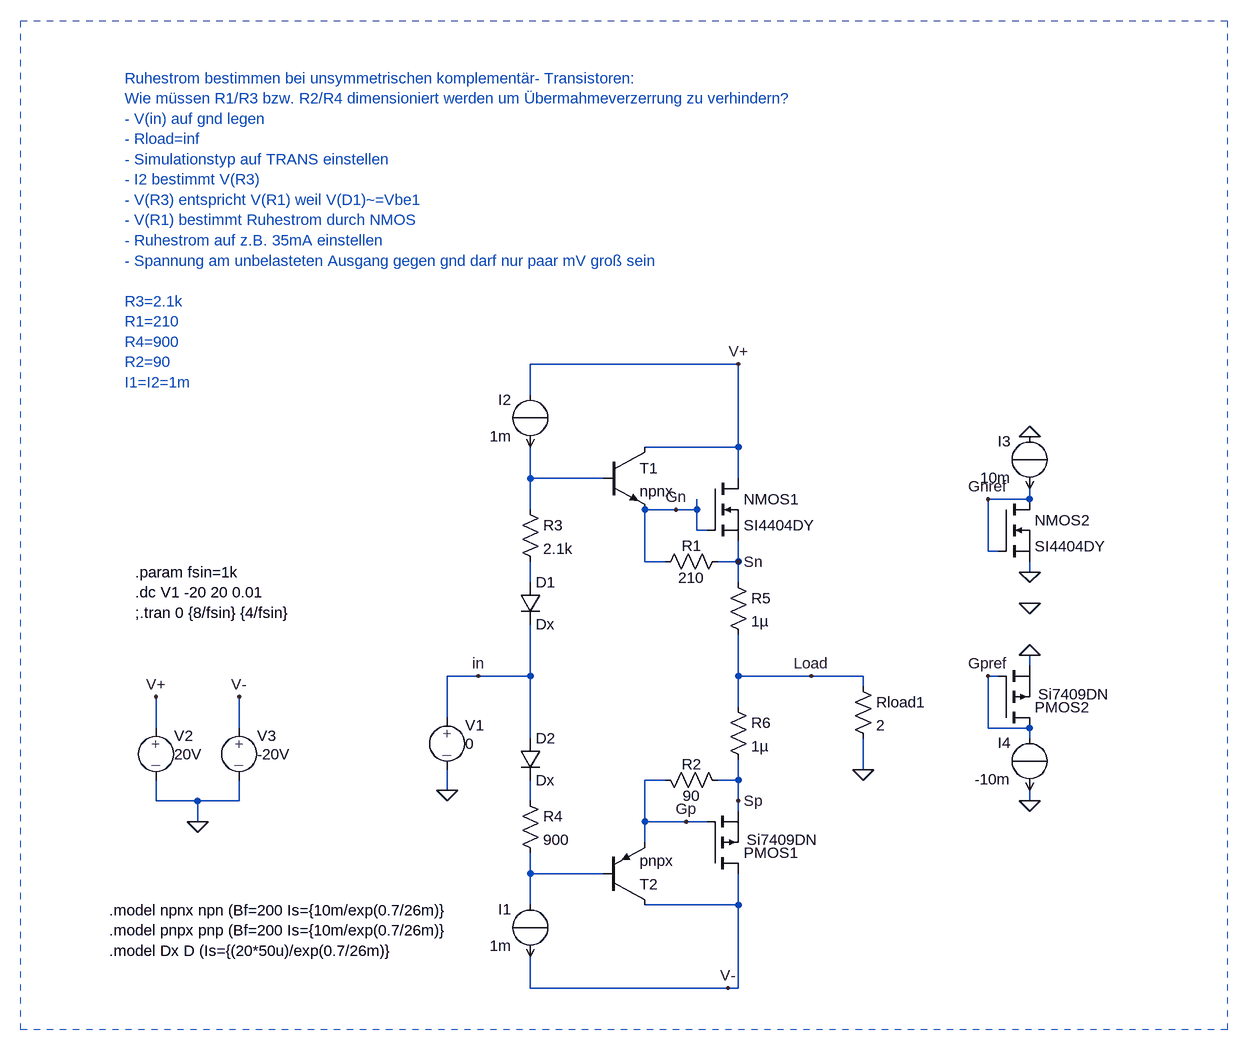
[diagram p0: schematic kompl_stufe_MOS_ruhestrom_messaufbau.asc]
kompl_stufe_MOS_ruhestrom_messaufbau.asc, the LTspice schematic file:
Version 4
SHEET 1 880 680
WIRE -544 -720 -864 -720
WIRE -864 -672 -864 -720
WIRE -544 -592 -544 -720
WIRE -544 -592 -688 -592
WIRE -864 -544 -864 -592
WIRE -752 -544 -864 -544
WIRE -544 -544 -544 -592
WIRE -96 -512 -96 -528
WIRE -96 -512 -160 -512
WIRE -864 -496 -864 -544
WIRE -640 -496 -688 -496
WIRE -608 -496 -608 -512
WIRE -608 -496 -640 -496
WIRE -608 -464 -608 -496
WIRE -592 -464 -608 -464
WIRE -160 -432 -160 -512
WIRE -144 -432 -160 -432
WIRE -688 -416 -688 -496
WIRE -656 -416 -688 -416
WIRE -544 -416 -544 -448
WIRE -544 -416 -576 -416
WIRE -96 -400 -96 -416
WIRE -864 -384 -864 -416
WIRE -544 -384 -544 -416
WIRE -96 -256 -96 -272
WIRE -944 -240 -992 -240
WIRE -864 -240 -864 -320
WIRE -864 -240 -944 -240
WIRE -544 -240 -544 -304
WIRE -432 -240 -544 -240
WIRE -352 -240 -432 -240
WIRE -144 -240 -160 -240
WIRE -352 -224 -352 -240
WIRE -544 -192 -544 -240
WIRE -992 -176 -992 -240
WIRE -1440 -160 -1440 -208
WIRE -1312 -160 -1312 -208
WIRE -160 -160 -160 -240
WIRE -96 -160 -160 -160
WIRE -864 -144 -864 -240
WIRE -96 -144 -96 -160
WIRE -352 -96 -352 -144
WIRE -656 -80 -688 -80
WIRE -544 -80 -544 -112
WIRE -544 -80 -576 -80
WIRE -992 -64 -992 -96
WIRE -1440 -48 -1440 -80
WIRE -1376 -48 -1440 -48
WIRE -1312 -48 -1312 -80
WIRE -1312 -48 -1376 -48
WIRE -864 -48 -864 -80
WIRE -544 -48 -544 -80
WIRE -96 -48 -96 -64
WIRE -544 -32 -544 -48
WIRE -1376 -16 -1376 -48
WIRE -688 -16 -688 -80
WIRE -624 -16 -688 -16
WIRE -592 -16 -624 -16
WIRE -688 16 -688 -16
WIRE -864 64 -864 32
WIRE -752 64 -864 64
WIRE -864 112 -864 64
WIRE -544 112 -544 64
WIRE -544 112 -688 112
WIRE -864 240 -864 192
WIRE -560 240 -864 240
WIRE -544 240 -544 112
WIRE -544 240 -560 240
FLAG -544 -720 V+
FLAG -560 240 V-
FLAG -992 -64 0
FLAG -432 -240 Load
FLAG -352 -96 0
FLAG -624 -16 Gp
FLAG -544 -48 Sp
FLAG -544 -416 Sn
FLAG -640 -496 Gn
FLAG -96 -400 0
FLAG -96 -48 0
FLAG -96 -352 0
FLAG -96 -608 0
FLAG -96 -272 0
FLAG -160 -240 Gpref
FLAG -160 -512 Gnref
FLAG -1376 -16 0
FLAG -1440 -208 V+
FLAG -1312 -208 V-
FLAG -944 -240 in
SYMBOL EIT_Semiconductors\\npn -752 -592 R0
SYMATTR InstName T1
SYMATTR Value npnx
SYMBOL EIT_Semiconductors\\pnp -752 112 M180
SYMATTR InstName T2
SYMATTR Value pnpx
SYMBOL res -672 -400 R270
WINDOW 0 25 56 VTop 0
WINDOW 3 7 56 VBottom 0
SYMATTR InstName R1
SYMATTR Value 210
SYMBOL res -560 -64 M270
WINDOW 0 25 56 VTop 0
WINDOW 3 7 56 VBottom 0
SYMATTR InstName R2
SYMATTR Value 90
SYMBOL res -880 -512 R0
SYMATTR InstName R3
SYMATTR Value 2.1k
SYMBOL res -880 -64 R0
SYMATTR InstName R4
SYMATTR Value 900
SYMBOL diode -880 -384 R0
SYMATTR InstName D1
SYMATTR Value Dx
SYMBOL diode -880 -144 R0
SYMATTR InstName D2
SYMATTR Value Dx
SYMBOL source-V -992 -192 R0
WINDOW 3 28 56 Left 0
WINDOW 123 0 0 Left 0
WINDOW 39 0 0 Left 0
SYMATTR Value 0
SYMATTR InstName V1
SYMBOL res -368 -240 R0
SYMATTR InstName Rload1
SYMATTR Value 2
SYMBOL EIT_Semiconductors\\nmos -592 -544 R0
SYMATTR InstName NMOS1
SYMATTR Value SI4404DY
SYMBOL EIT_Semiconductors\\pmos -592 64 M180
WINDOW 3 61 52 Left 0
SYMATTR InstName PMOS1
SYMATTR Value Si7409DN
SYMBOL res -560 -400 R0
SYMATTR InstName R5
SYMATTR Value 1µ
SYMBOL res -560 -208 R0
SYMATTR InstName R6
SYMATTR Value 1µ
SYMBOL source-I -864 192 R180
WINDOW 0 29 73 Left 0
WINDOW 3 29 17 Left 0
WINDOW 123 0 0 Left 0
WINDOW 39 0 0 Left 0
SYMATTR InstName I1
SYMATTR Value 1m
SYMBOL source-I -864 -592 R180
WINDOW 0 29 73 Left 0
WINDOW 3 29 17 Left 0
WINDOW 123 0 0 Left 0
WINDOW 39 0 0 Left 0
SYMATTR InstName I2
SYMATTR Value 1m
SYMBOL EIT_Semiconductors\\nmos -144 -512 R0
SYMATTR InstName NMOS2
SYMATTR Value SI4404DY
SYMBOL EIT_Semiconductors\\pmos -144 -160 M180
WINDOW 3 61 52 Left 0
SYMATTR InstName PMOS2
SYMATTR Value Si7409DN
SYMBOL source-I -96 -528 R180
WINDOW 0 29 73 Left 0
WINDOW 3 29 17 Left 0
WINDOW 123 0 0 Left 0
WINDOW 39 0 0 Left 0
SYMATTR InstName I3
SYMATTR Value 10m
SYMBOL source-I -96 -64 R180
WINDOW 0 29 73 Left 0
WINDOW 3 29 17 Left 0
WINDOW 123 0 0 Left 0
WINDOW 39 0 0 Left 0
SYMATTR InstName I4
SYMATTR Value -10m
SYMBOL source-V -1440 -176 R0
WINDOW 3 28 56 Left 0
WINDOW 123 0 0 Left 0
WINDOW 39 0 0 Left 0
SYMATTR Value 20V
SYMATTR InstName V2
SYMBOL source-V -1312 -176 R0
WINDOW 3 28 56 Left 0
WINDOW 123 0 0 Left 0
WINDOW 39 0 0 Left 0
SYMATTR Value -20V
SYMATTR InstName V3
TEXT -1472 -400 Left 0 !.param fsin=1k\n.dc V1 -20 20 0.01\n;.tran 0 {8/fsin} {4/fsin}
TEXT -1512 120 Left 0 !.model npnx npn (Bf=200 Is={10m/exp(0.7/26m)}\n.model pnpx pnp (Bf=200 Is={10m/exp(0.7/26m)}\n.model Dx D (Is={(20*50u)/exp(0.7/26m)}
TEXT -1488 -1160 Left 0 ;Ruhestrom bestimmen bei unsymmetrischen komplementär- Transistoren:\nWie müssen R1/R3 bzw. R2/R4 dimensioniert werden um Übermahmeverzerrung zu verhindern?\n- V(in) auf gnd legen\n- Rload=inf\n- Simulationstyp auf TRANS einstellen\n- I2 bestimmt V(R3)\n- V(R3) entspricht V(R1) weil V(D1)~=Vbe1\n- V(R1) bestimmt Ruhestrom durch NMOS\n- Ruhestrom auf z.B. 35mA einstellen\n- Spannung am unbelasteten Ausgang gegen gnd darf nur paar mV groß sein\n \nR3=2.1k\nR1=210\nR4=900\nR2=90\nI1=I2=1m
RECTANGLE Normal 208 304 -1648 -1248 2

The netlist it stands for:
* kompl_stufe_MOS_ruhestrom_messaufbau.asc
Q§T1 V+ N001 Gn 0 npnx
Q§T2 V- N004 Gp 0 pnpx
R1 Gn Sn 210
R2 Sp Gp 90
R3 N001 N002 2.1k
R4 N003 N004 900
D1 N002 in Dx
D2 in N003 Dx
V1 in 0 0
Rload1 Load 0 2
M§NMOS1 V+ Gn Sn Sn SI4404DY
M§PMOS1 V- Gp Sp Sp Si7409DN
R5 Sn Load 1µ
R6 Load Sp 1µ
I1 N004 V- 1m
I2 V+ N001 1m
M§NMOS2 Gnref Gnref 0 0 SI4404DY
M§PMOS2 Gpref Gpref 0 0 Si7409DN
I3 0 Gnref 10m
I4 Gpref 0 -10m
V2 V+ 0 20V
V3 V- 0 -20V
.model D D
.lib standard.dio
.model NPN NPN
.model PNP PNP
.lib standard.bjt
.model NMOS NMOS
.model PMOS PMOS
.lib standard.mos
.param fsin=1k
.dc V1 -20 20 0.01
;.tran 0 {8/fsin} {4/fsin}
.model npnx npn (Bf=200 Is={10m/exp(0.7/26m)}
.model pnpx pnp (Bf=200 Is={10m/exp(0.7/26m)}
.model Dx D (Is={(20*50u)/exp(0.7/26m)}
* Ruhestrom bestimmen bei unsymmetrischen komplementär- Transistoren:
* Wie müssen R1/R3 bzw. R2/R4 dimensioniert werden um Übermahmeverzerrung zu verhindern?
* - V(in) auf gnd legen
* - Rload=inf
* - Simulationstyp auf TRANS einstellen
* - I2 bestimmt V(R3)
* - V(R3) entspricht V(R1) weil V(D1)~=Vbe1
* - V(R1) bestimmt Ruhestrom durch NMOS
* - Ruhestrom auf z.B. 35mA einstellen
* - Spannung am unbelasteten Ausgang gegen gnd darf nur paar mV groß sein
* R3=2.1k
* R1=210
* R4=900
* R2=90
* I1=I2=1m
.backanno
.end